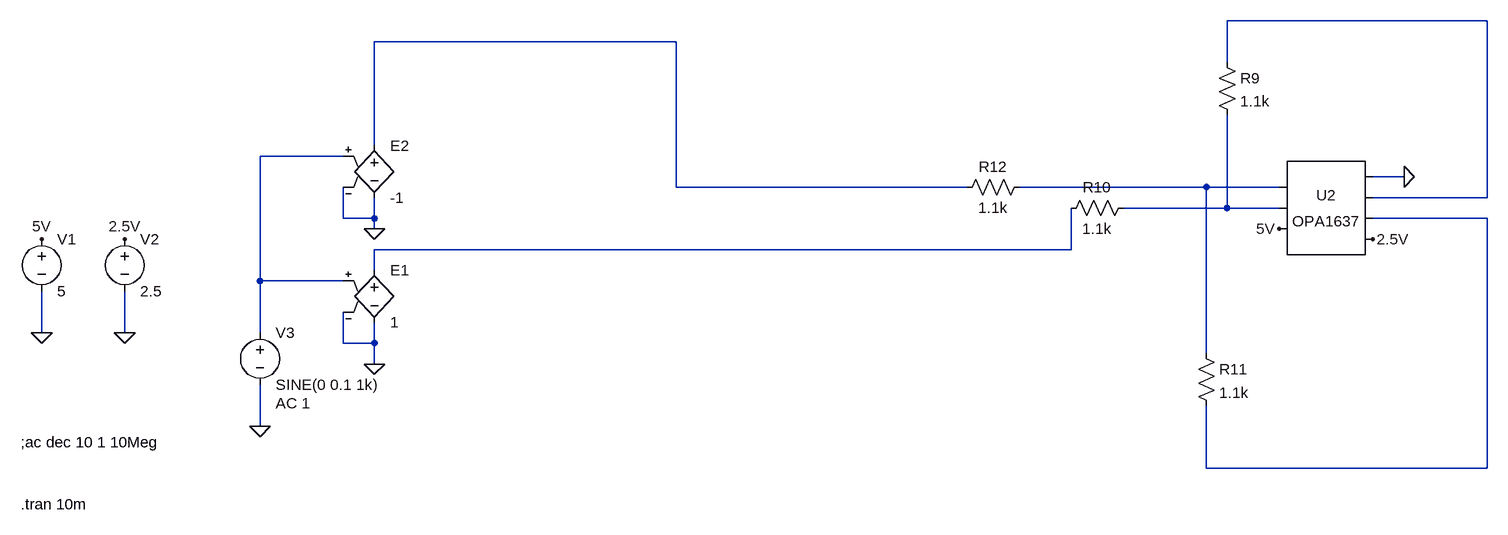
[diagram p0: schematic inverter_check1.asc]
inverter_check1.asc, the LTspice schematic file:
Version 4
SHEET 1 2404 680
WIRE 1888 -112 1488 -112
WIRE 640 -80 176 -80
WIRE 1488 -48 1488 -112
WIRE 176 80 176 -80
WIRE 128 96 0 96
WIRE 1760 128 1712 128
WIRE 640 144 640 -80
WIRE 1088 144 640 144
WIRE 1456 144 1168 144
WIRE 1568 144 1456 144
WIRE 1888 160 1888 -112
WIRE 1888 160 1712 160
WIRE 1488 176 1488 32
WIRE 1488 176 1328 176
WIRE 1568 176 1488 176
WIRE 128 192 128 144
WIRE 176 192 176 160
WIRE 176 192 128 192
WIRE 1888 192 1712 192
WIRE 176 208 176 192
WIRE 1248 240 1248 176
WIRE 1248 240 176 240
WIRE 176 272 176 240
WIRE 0 288 0 96
WIRE 128 288 0 288
WIRE -336 368 -336 304
WIRE -208 368 -208 304
WIRE 0 368 0 288
WIRE 128 384 128 336
WIRE 176 384 176 352
WIRE 176 384 128 384
WIRE 1456 400 1456 144
WIRE 176 416 176 384
WIRE 0 512 0 448
WIRE 1456 576 1456 480
WIRE 1888 576 1888 192
WIRE 1888 576 1456 576
FLAG -336 368 0
FLAG -336 224 5V
FLAG -208 368 0
FLAG -208 224 2.5V
FLAG 0 512 0
FLAG 176 416 0
FLAG 176 208 0
FLAG 1568 208 5V
FLAG 1712 224 2.5V
FLAG 1760 128 0
SYMBOL voltage -336 208 R0
WINDOW 123 0 0 Left 0
WINDOW 39 0 0 Left 0
SYMATTR InstName V1
SYMATTR Value 5
SYMBOL voltage -208 208 R0
WINDOW 123 0 0 Left 0
WINDOW 39 0 0 Left 0
SYMATTR InstName V2
SYMATTR Value 2.5
SYMBOL voltage 0 352 R0
WINDOW 123 24 124 Left 2
WINDOW 39 0 0 Left 0
SYMATTR Value2 AC 1
SYMATTR InstName V3
SYMATTR Value SINE(0 0.1 1k)
SYMBOL e 176 256 R0
SYMATTR InstName E1
SYMATTR Value 1
SYMBOL e 176 64 R0
SYMATTR InstName E2
SYMATTR Value -1
SYMBOL AutoGenerated\\OPA1637 1632 176 R0
SYMATTR InstName U2
SYMBOL res 1472 -64 R0
SYMATTR InstName R9
SYMATTR Value 1.1k
SYMBOL res 1344 160 R90
WINDOW 0 0 56 VBottom 2
WINDOW 3 32 56 VTop 2
SYMATTR InstName R10
SYMATTR Value 1.1k
SYMBOL res 1440 384 R0
SYMATTR InstName R11
SYMATTR Value 1.1k
SYMBOL res 1184 128 R90
WINDOW 0 0 56 VBottom 2
WINDOW 3 32 56 VTop 2
SYMATTR InstName R12
SYMATTR Value 1.1k
TEXT -368 536 Left 2 !;ac dec 10 1 10Meg
TEXT -368 632 Left 2 !.tran 10m

The netlist it stands for:
* inverter_check1.asc
V1 5V 0 5
V2 2.5V 0 2.5
V3 N003 0 SINE(0 0.1 1k) AC 1
E1 N007 0 N003 0 1
E2 N002 0 N003 0 -1
* U2: OPA1637 (symbol AutoGenerated\OPA1637 not available, pins judged from their places): pin1=N004 pin2=N005 pin3=5V pin4=0 pin5=N001 pin6=N006 pin7=2.5V
R9 N001 N005 1.1k
R10 N005 N007 1.1k
R11 N004 N006 1.1k
R12 N004 N002 1.1k
;ac dec 10 1 10Meg
.tran 10m
.backanno
.end